# EAGLE design PIC_backpack (EAGLE 8.2.1)
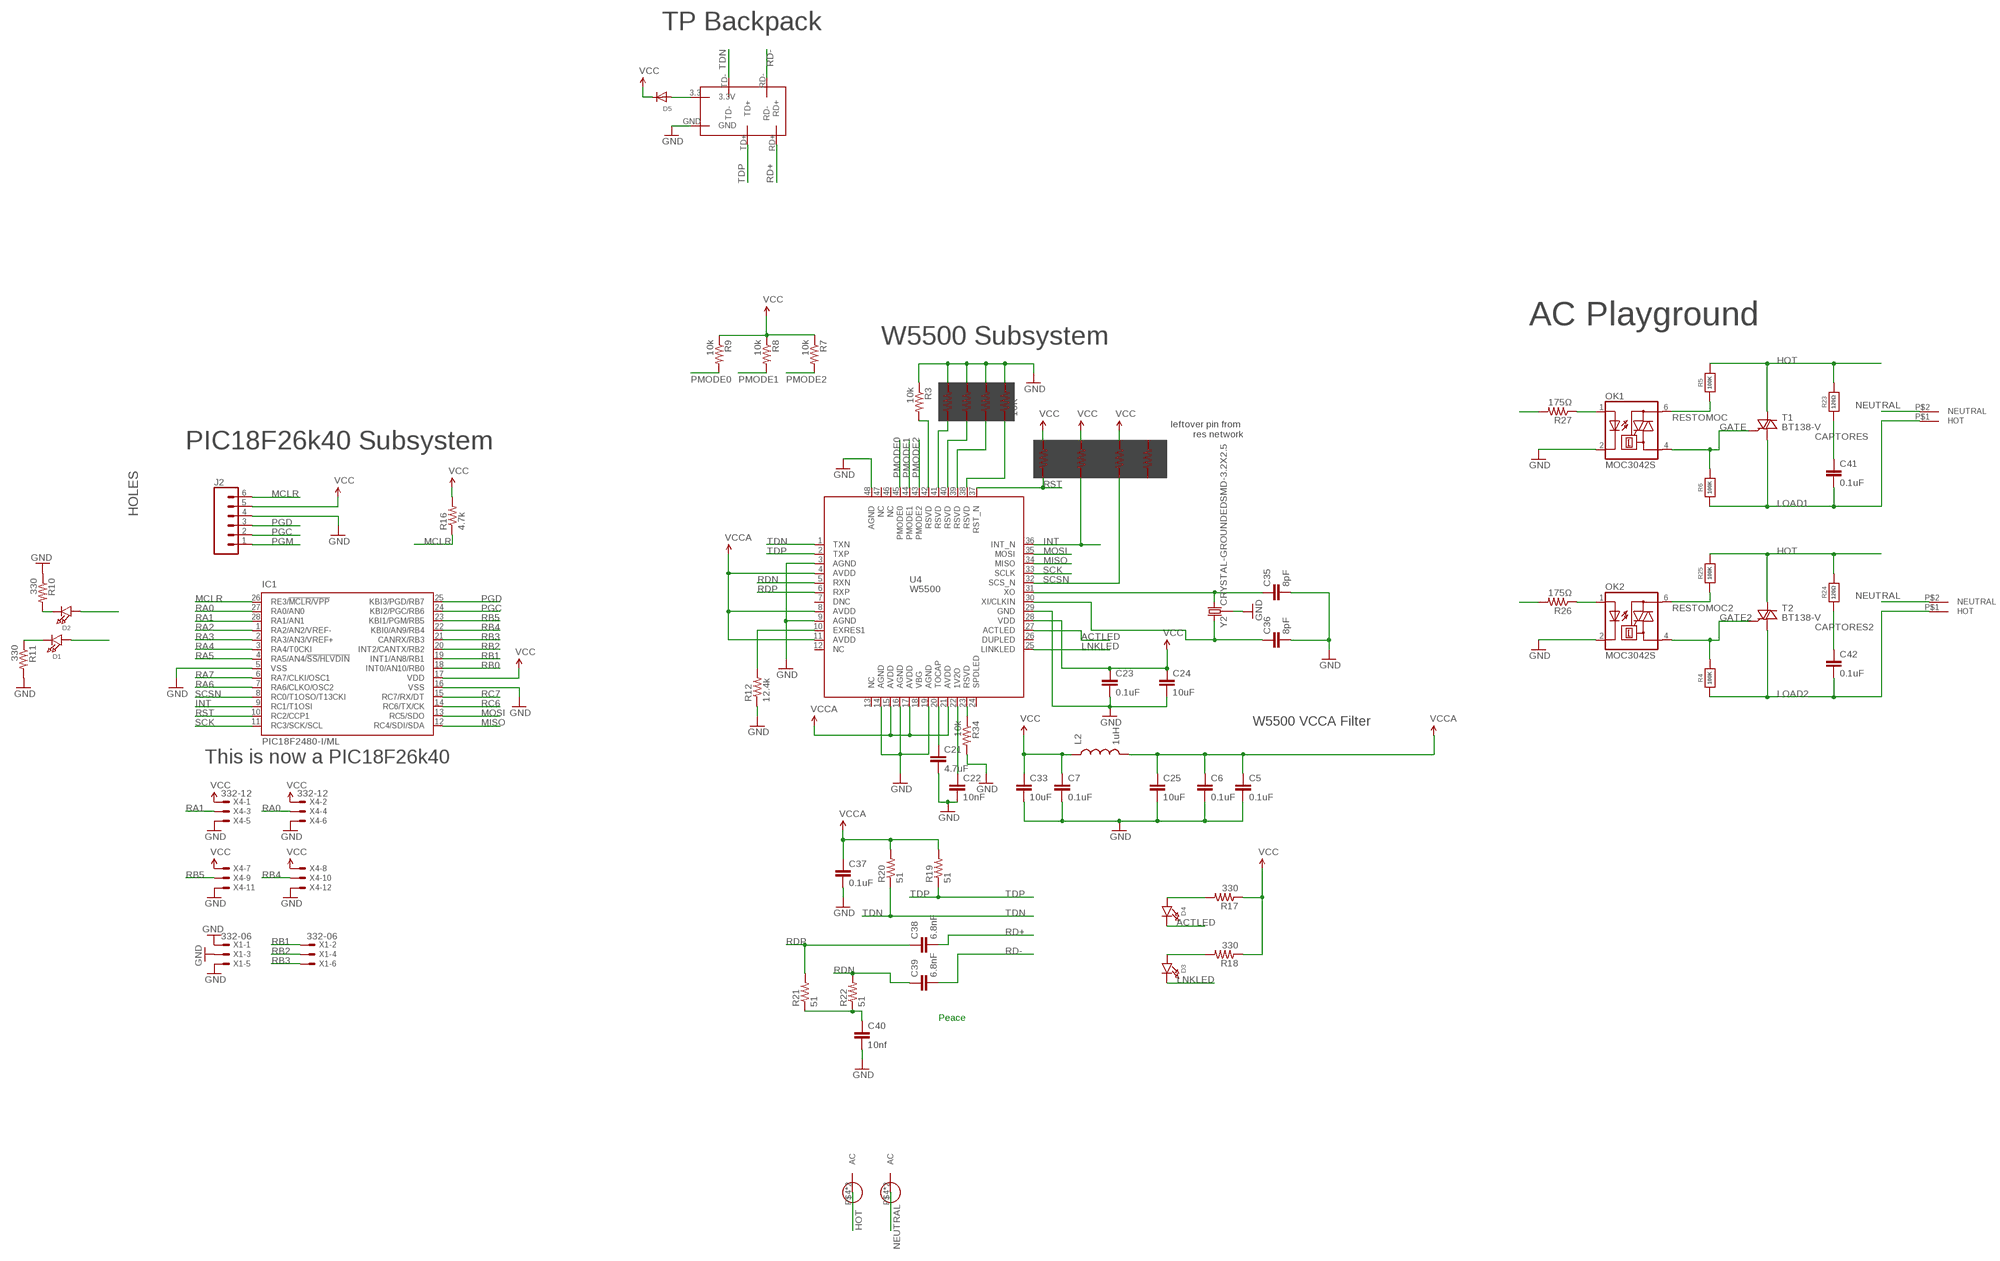
[diagram p0: schematic, sheet 1]

## Parts
C5  0.1uF  CAP0603-CAP  [0603-CAP]
C6  0.1uF  CAP0603-CAP  [0603-CAP]
C7  0.1uF  CAP0603-CAP  [0603-CAP]
C21  4.7uF  CAP0603-CAP  [0603-CAP]
C22  10nF  CAP0603-CAP  [0603-CAP]
C23  0.1uF  CAP0603-CAP  [0603-CAP]
C24  10uF  CAP0603-CAP  [0603-CAP]
C25  10uF  CAP0603-CAP  [0603-CAP]
C33  10uF  CAP0603-CAP  [0603-CAP]
C35  8pF  CAP0603-CAP  [0603-CAP]
C36  8pF  CAP0603-CAP  [0603-CAP]
C37  0.1uF  CAP0603-CAP  [0603-CAP]
C38  6.8nF  CAP0603-CAP  [0603-CAP]
C39  6.8nF  CAP0603-CAP  [0603-CAP]
C40  10nf  CAP0603-CAP  [0603-CAP]
C41  0.1uF  CAP1210  [1210]
C42  0.1uF  CAP1210  [1210]
D1  LED0603_NOOUTLINE  [CHIPLED_0603_NOOUTLINE]
D2  LED0603_NOOUTLINE  [CHIPLED_0603_NOOUTLINE]
D3  LED0603_NOOUTLINE  [CHIPLED_0603_NOOUTLINE]
D4  LED0603_NOOUTLINE  [CHIPLED_0603_NOOUTLINE]
D5  DIODESOD-123  [SOD-123]
IC1  PIC18F2480-I/ML  [QFN28-ML_6X6MM]
J2  CONN_06NO_SILK_FEMALE_PTH  [1X06_NO_SILK]
L2  1uH  INDUCTOR0603  [0603]
OK1  MOC3042S  [DIL6-SMD]
OK2  MOC3042S  [DIL6-SMD]
R1  10K  RESISTOR_4PACK_US  [RESPACK_4X0603]
R2  10K  RESISTOR_4PACK_US  [RESPACK_4X0603]
R3  10k  RESISTOR0603-RES  [0603-RES]
R4  100K  RESISTOR0805_10MGAP  [0805_10MGAP]
R5  100K  RESISTOR0805_10MGAP  [0805_10MGAP]
R6  100K  RESISTOR0805_10MGAP  [0805_10MGAP]
R7  10k  RESISTOR0603-RES  [0603-RES]
R8  10k  RESISTOR0603-RES  [0603-RES]
R9  10k  RESISTOR0603-RES  [0603-RES]
R10  330  RESISTOR0603-RES  [0603-RES]
R11  330  RESISTOR0603-RES  [0603-RES]
R12  12.4k  RESISTOR0603-RES  [0603-RES]
R16  4.7k  RESISTOR0603-RES  [0603-RES]
R17  330  RESISTOR0603-RES  [0603-RES]
R18  330  RESISTOR0603-RES  [0603-RES]
R19  51  RESISTOR0603-RES  [0603-RES]
R20  51  RESISTOR0603-RES  [0603-RES]
R21  51  RESISTOR0603-RES  [0603-RES]
R22  51  RESISTOR0603-RES  [0603-RES]
R23  120Ω  RESISTOR0805_10MGAP  [0805_10MGAP]
R24  120Ω  RESISTOR0805_10MGAP  [0805_10MGAP]
R25  100K  RESISTOR0805_10MGAP  [0805_10MGAP]
R26  175Ω  RESISTOR0603-RES  [0603-RES]
R27  175Ω  RESISTOR0603-RES  [0603-RES]
R34  10k  RESISTOR0603-RES  [0603-RES]
T1  BT138-V  [TO220BV]
T2  BT138-V  [TO220BV]
U4  W5500  [W5500]
U$1  TPLINK_BACKPACK  [BACKPACK_WITH_PROTO]
U$2  AC_BLADE  [AC_BLADE]
U$3  AC_BLADE  [AC_BLADE]
U$4  AC_TERMINAL  [AC_TERMINAL]
U$5  AC_TERMINAL  [AC_TERMINAL]
X1  332-06  [332-06]
X4  332-12  [332-12]
Y2  CRYSTAL-GROUNDEDSMD-3.2X2.5  [CRYSTAL-SMD-3.2X2.5MM]

## Nets
ACTLED: D4.C U4.27(ACTLED)
CAPTORES: C41.1 R23.1
CAPTORES2: C42.1 R24.1
GATE: OK1.4(A1) R6.2 T1.G
GATE2: OK2.4(A1) R4.2 T2.G
GND: C5.2 C6.2 C7.2 C21.2 C22.2 C23.2 C24.2 C25.2 C33.2 C35.2 C36.2 C37.2 C40.2 IC1.5(VSS) IC1.16(VSS) J2.4 OK1.2(C) OK2.2(C) R1.5 R1.6 R1.7 R1.8 R3.1 R10.1 R11.2 R12.1 R34.2 U4.3(AGND) U4.9(AGND) U4.14(AGND) U4.16(AGND) U4.19(AGND) U4.29(GND) U4.48(AGND) U$1.GND X1.1 X1.3 X1.5 X4.5 X4.6 X4.11 X4.12 Y2.2 Y2.4
HOT: R5.2 R23.2 R24.2 R25.2 T1.T2(A2) T2.T2(A2) U$2.P$4(AC) U$2.P$5(AC)
INT: IC1.9(RC1/T1OSI) R2.3 U4.36(INT_N)
LNKLED: D3.C U4.25(LINKLED)
LOAD1: C41.2 R6.1 T1.T1(A1) U$5.P$1(HOT)
LOAD2: C42.2 R4.1 T2.T1(A1) U$4.P$1(HOT)
MCLR: IC1.26(RE3/!MCLR/VPP) J2.6 R16.1
MISO: IC1.12(RC4/SDI/SDA) U4.34(MISO)
MOSI: IC1.13(RC5/SDO) U4.35(MOSI)
N$1: R3.2 U4.42(RSVD)
N$2: D2.C R10.2
N$3: C21.1 U4.20(TOCAP)
N$5: D1.C R11.1
N$8: C22.1 U4.22(1V2O)
N$10: R12.2 U4.10(EXRES1)
N$12: D4.A R17.2
N$13: D3.A R18.2
N$15: D5.A U$1.3.3(3.3V)
N$16: C40.1 R21.1 R22.1
N$17: R1.1 U4.41(RSVD)
N$18: R1.3 U4.39(RSVD)
N$19: R1.2 U4.40(RSVD)
N$21: R1.4 U4.38(RSVD)
N$22: R34.1 U4.23(RSVD)
N$23: C35.1 U4.31(XO) Y2.3
N$24: C36.1 U4.30(XI/CLKIN) Y2.1
N$26: OK1.1(A) R27.1
N$29: OK2.1(A) R26.1
NEUTRAL: U$3.P$4(AC) U$3.P$5(AC) U$4.P$2(NEUTRAL) U$5.P$2(NEUTRAL)
PGC: IC1.24(KBI2/PGC/RB6) J2.2
PGD: IC1.25(KBI3/PGD/RB7) J2.3
PGM: J2.1
PMODE0: R9.2 U4.45(PMODE0)
PMODE1: R8.2 U4.44(PMODE1)
PMODE2: R7.2 U4.43(PMODE2)
RA0: IC1.27(RA0/AN0) X4.4
RA1: IC1.28(RA1/AN1) X4.3
RA2: IC1.1(RA2/AN2/VREF-)
RA3: IC1.2(RA3/AN3/VREF+)
RA4: IC1.3(RA4/T0CKI) R26.2
RA5: IC1.4(RA5/AN4/!SS/HLVDIN) R27.2
RA6: IC1.7(RA6/CLKO/OSC2)
RA7: IC1.6(RA7/CLKI/OSC1)
RB0: IC1.18(INT0/AN10/RB0)
RB1: IC1.19(INT1/AN8/RB1) X1.2
RB2: IC1.20(INT2/CANTX/RB2) X1.4
RB3: IC1.21(CANRX/RB3) X1.6
RB4: IC1.22(KBI0/AN9/RB4) X4.10
RB5: IC1.23(KBI1/PGM/RB5) X4.9
RC6: D2.A IC1.14(RC6/TX/CK)
RC7: D1.A IC1.15(RC7/RX/DT)
RD+: C38.2 U$1.RD+
RD-: C39.2 U$1.RD-
RDN: C39.1 R22.2 U4.5(RXN)
RDP: C38.1 R21.2 U4.6(RXP)
RESTOMOC: OK1.6(A2) R5.1
RESTOMOC2: OK2.6(A2) R25.1
RST: IC1.10(RC2/CCP1) R2.2 U4.37(RST_N)
SCK: IC1.11(RC3/SCK/SCL) U4.33(SCLK)
SCSN: IC1.8(RC0/T1OSO/T13CKI) R2.4 U4.32(SCS_N)
TDN: R20.1 U4.1(TXN) U$1.TD-
TDP: R19.1 U4.2(TXP) U$1.TD+
VCC: C7.1 C23.1 C24.1 C33.1 D5.C IC1.17(VDD) J2.5 L2.1 R2.5 R2.6 R2.7 R7.1 R8.1 R9.1 R16.2 R17.1 R18.1 U4.28(VDD) X4.1 X4.2 X4.7 X4.8
VCCA: C5.1 C6.1 C25.1 C37.1 L2.2 R19.2 R20.2 U4.4(AVDD) U4.8(AVDD) U4.11(AVDD) U4.15(AVDD) U4.17(AVDD) U4.21(AVDD)
Unconnected: R2.1 R2.8 U4.7(DNC) U4.12(NC) U4.13(NC) U4.18(VBG) U4.24(SPDLED) U4.26(DUPLED) U4.46(NC) U4.47(NC)

## Notes on the sheet
- TP Backpack
- AC Playground
- W5500 Subsystem
- leftover pin from 
  res network
- PIC18F26k40 Subsystem
- HOLES
- W5500 VCCA Filter
- This is now a PIC18F26k40
- Peace

## Library data of the parts
C5-C7 C21-C25 C33 C35-C40 = SparkFun-Passives:CAP: Capacitor Standard 0603 ceramic capacitor, and 0.1" leaded capacitor.
C41 C42 = SparkFun-Capacitors:CAP: Capacitor Standard 0603 ceramic capacitor, and 0.1" leaded capacitor.
D1-D4 = microbuilder:LED: LED 0603 - 0603 Surface Mount Package 2mA: Green LED - Low Power (3.9mcd, 2ma, 1.7Vf) - Digikey: 475-2709-2-ND Orange LED - Low Power (9.8mcd, 2ma, 1.8Vf) - Digikey: 475-1194-2-ND Red LED - Low Power (5mcd, 2ma, 1.8Vf) - Digikey: 475-1195-2-ND Yellow LED - Low Power (7mcd, 2ma, 1.8Vf) - Digikey: 475-1196-2-ND 5mA: Blue LED - Low Power (17mcd, 5ma, 2.9Vf) - Digikey: LNJ937W8CRACT-ND 0805 - 0805 Surface Mount Package 2mA: Red LED (8.8mcd, 2mA, 1.8Vf, Clear) - Low Power [Digikey: 475-2510-1-ND] Green LED (5mcd, 2mA, 1.8Vf, Clear) - Low Power [Digikey: 475-2730-1-ND] Yellow LED (11.3mcd, 2mA, 1.8Vf, Clear) - Low Power [Digikey: 475-2555-1-ND] 20mA: Red LED (104mcd, 20mA, Diffused) - LS R976 [Digikey: 475-1278-6-ND] Red LED (12mcd, 20mA, 2.0Vf, Clear) - APT2012EC [Digikey: 754-1128-1-ND] Green LED (15mcd, 20mA, 2.2Vf, Clear) - APT2012GC [Digikey: 754-1131-1-ND] Orange LED (160mcd, 20mA, 2.1Vf, Clear) - APT2012SECK [Digikey: 754-1130-1-ND] 1206 - 1206 Surface Mount Package Green LED (26mcd, 20mA, Diffused) - LG N971 [Digikey: 475-1407-6-ND] Red LED (15mcd, 20mA, Diffused) - LH N974 [Digikey: 475-1416-6-ND] Cree - Cree High-Power Surface Mount LEDs XPEBWT-L1-0000-00D50 - White 111lm 350mA 2.9Vf 6200K 110° XTEAWT-00-0000-00000LEE3 - White 114lm 350mA 2.85Vf 5000K 115° Everlight - Everlight 45-21 Series Surface Mount LEDs 45-21/QK2C-B2832AC2CB2/2T - Warm White 2000mcd 20mA 3.25Vf 3050K 120° 45-21/LK2C-B38452C4CB2/2T - Nuetral White 2000mcd 20mA 3.25Vf 4150K 120° 45-21/LK2C-B50634C6CB2/2T - Cold White 2200mcd 20mA 3.25Vf 5650K 120° PLCC2 Reverse Mount LS T77K-J1L2-1-0-2-R18-Z - Red 11.25mcd 2mA 1.8Vf 630nm 120° LO T77K-L1M2-24-Z - Orange 19.6mcd 2mA 1.8Vf 606nm 120° LY T77K-K2M1-26-Z - Yellow 15.7mcd 2mA 1.8Vf 587nm 120°
D5 = adafruit:DIODE: Diode SMADIODE - SMA Surface Mount Package 20V 1A Schottky Diode Digikey: 641-1014-6-ND DO-1N4148 - Through Hole Small Current Diode SOD-123 20V 1 A (.5mV Vf) Schottky Diode - Digikey: MBRX120TPMSCT-ND SOD-323 10V 570mA (.38mV Vf, 3ns) Schottky Diode - Digikey: ZLLS410CT-ND SOD-523 30V 30mA Schottky Diode (RB751S-40TE61) - Digikey: RB751S-40TE61CT-ND SOT23-R/W - SOT23 Package (R = Solder Paste/Reflow Ovens, W = Hand-Soldering) BAT54Film 40V 300mA - Digikey: 497-7162-1-ND
IC1 = microchip:PIC18F2*80: 28-Pin Enhanced Flash Microcontrollers with ECAN(TM) Technology 10-Bit A/D and nanoWatt Technology Source: http://www.microchip.com .. 39637a.pdf; MF: MICROCHIP; MPN: PIC18F2480-I/ML; OC_FARNELL: 1556179; OC_NEWARK: 71J7235
J2 = SparkFun-Connectors:CONN_06: Multi connection point. Often used as Generic Header-pin footprint for 0.1 inch spaced/style header connections On any of the 0.1 inch spaced packages, you can populate with these: Break Away Headers - Straight <https://www.sparkfun.com/products/116> (PRT-00116) Break Away Male Headers - Right Angle <https://www.sparkfun.com/products/553> (PRT-00553) Female Headers <https://www.sparkfun.com/products/115> (PRT-00115) Break Away Headers - Machine Pin <https://www.sparkfun.com/products/117> (PRT-00117) Break Away Female Headers - Swiss Machine Pin <https://www.sparkfun.com/products/743> (PRT-00743) Arduino Stackable Header - 6 Pin <https://www.sparkfun.com/products/9280> (PRT-09280) For SCREWTERMINALS and SPRING TERMINALS visit here: Screw Terimnals on SparkFun.com <https://www.sparkfun.com/search/results?term=Screw+Terminals> (5mm/3.5mm/2.54mm spacing) This device is also useful as a general connection point to wire up your design to another part of your project. Our various solder wires solder well into these plated through hole pads. Hook-Up Wire - Assortment (Stranded, 22 AWG) <https://www.sparkfun.com/products/11375> (PRT-11375) Hook-Up Wire - Assortment (Solid Core, 22 AWG) <https://www.sparkfun.com/products/11367> (PRT-11367) View the entire wire category on our website here <https://www.sparkfun.com/categories/141>; PROD_ID: CONN-08437
L2 = SparkFun-Passives:INDUCTOR: Inductors Basic Inductor/Choke - 0603 and 1206. Footprints are not proven and vary greatly between part numbers. INDUCTOR POWER 3.3UH 4.0A SMD 0.197" L x 0.197" W x 0.177" H (5.00mm x 5.00mm x 4.50mm)
OK1 OK2 = optocoupler:MOC30*: 6-Pin DIP Zero-Cross Optoisolators Triac Driver Output (250/400 Volt Peak) Source: Data sheet <http://www.fairchildsemi.com/ds/MO/MOC3031M.pdf> The old path of data sheet not more available 2013-05-06.; MF: FAIRCHILD SEMICONDUCTOR; MPN: MOC3042SM; OC_FARNELL: unknown; OC_NEWARK: 34C1339
R1 R2 = microbuilder:RESISTOR_4PACK_US: Resistor Packs (4 resistors) 4 x 0603 10K 1/16W - Digikey: YC164J-10KCT-ND
R3 R7-R12 R16-R22 R26 R27 R34 = SparkFun-Passives:RESISTOR: Resistor Basic schematic elements and footprints for 0603, 1206, and PTH resistors.
R4-R6 R23-R25 = microbuilder:RESISTOR: Resistors For new designs, use the packages preceded by an '_' character since they are more reliable: The following footprints should be used on most boards: _0402 - Standard footprint for regular board layouts _0603 - Standard footprint for regular board layouts _0805 - Standard footprint for regular board layouts _1206 - Standard footprint for regular board layouts For extremely tight-pitch boards where space is at a premium, the following 'micro-pitch' footprints can be used (smaller pads, no silkscreen outline, etc.): _0402MP - Micro-pitch footprint for very dense/compact boards _0603MP - Micro-pitch footprint for very dense/compact boards _0805MP - Micro-pitch footprint for very dense/compact boards _1206MP - Micro-pitch footprint for very dense/compact boards
T1 T2 = triac:BT138: TRIAC Source: http://www.semiconductors.philips.com BT138_SERIES_2.pdf
U4 = W5500:W5500
U$1 = Heep:TPLINK_BACKPACK
U$2 U$3 = Heep:AC_BLADE
U$4 U$5 = Heep:AC_TERMINAL
X1 = con-garry:332-06: 6 Pin - 2mm Dual Row Source: www.mpe-connector.de / garry_shortform_2012.pdf
X4 = con-garry:332-12: 12 Pin - 2mm Dual Row Source: www.mpe-connector.de / garry_shortform_2012.pdf
Y2 = SparkFun-Clocks:CRYSTAL-GROUNDED: Crystals w/ Ground Pin (Generic) These are passive quartz crystals, which can be used as a clock source for a microcontroller. Crystal's are usually two-terminal devices. A third terminal may be optionally connected to ground, as recommended by the manufaturer.

## Board
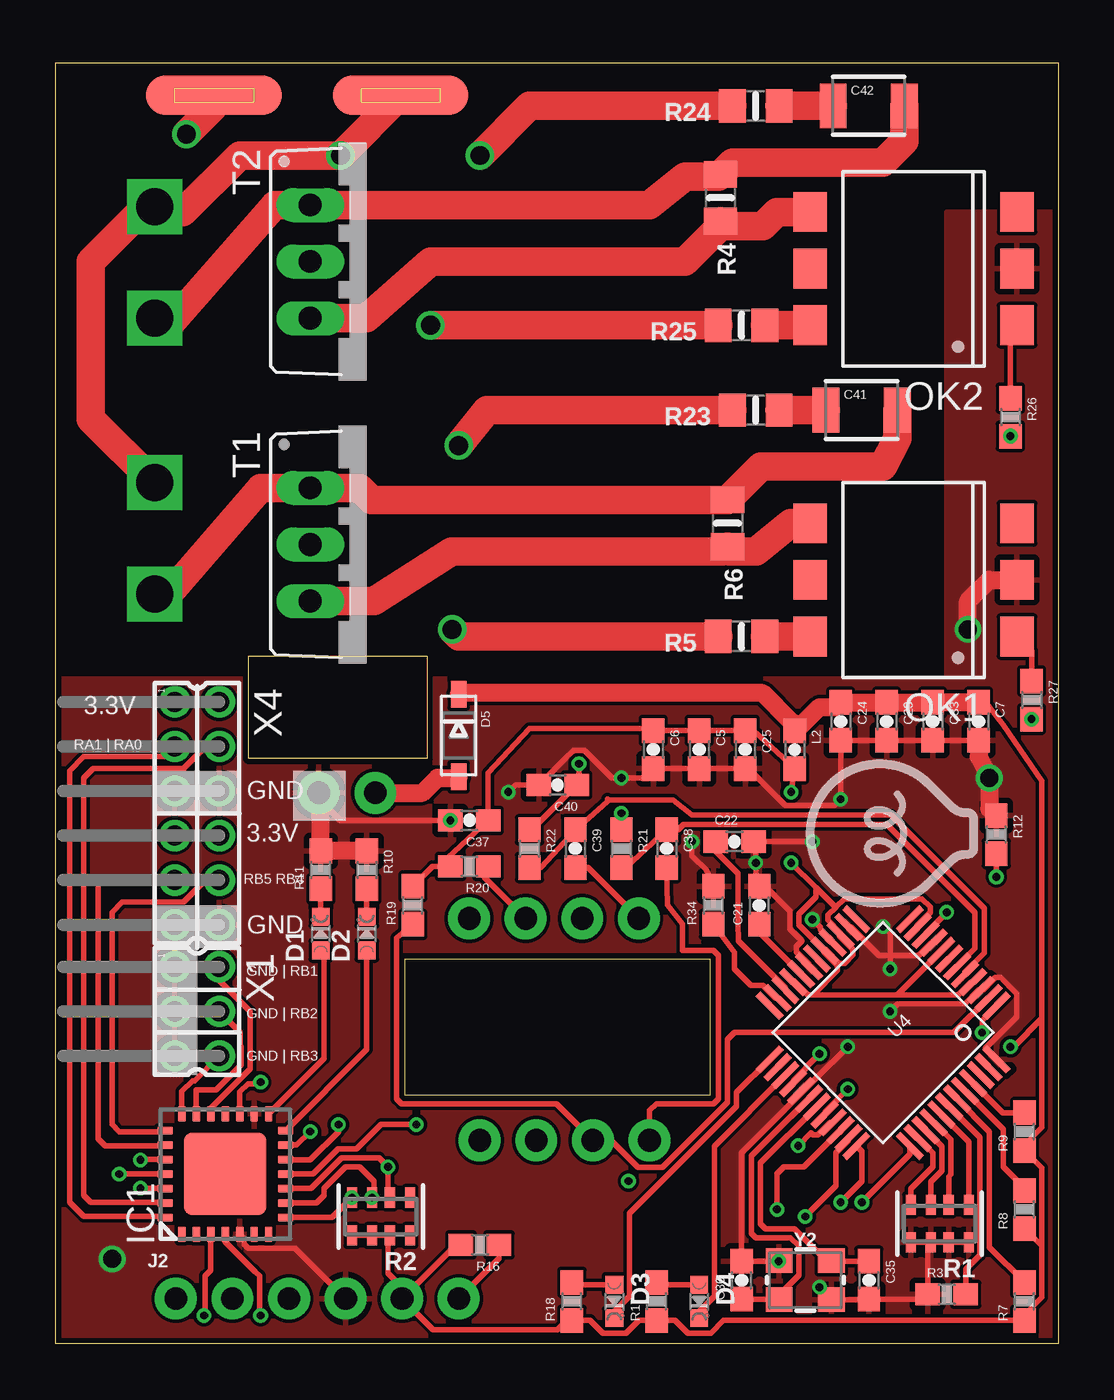
[diagram p1: board, top side]
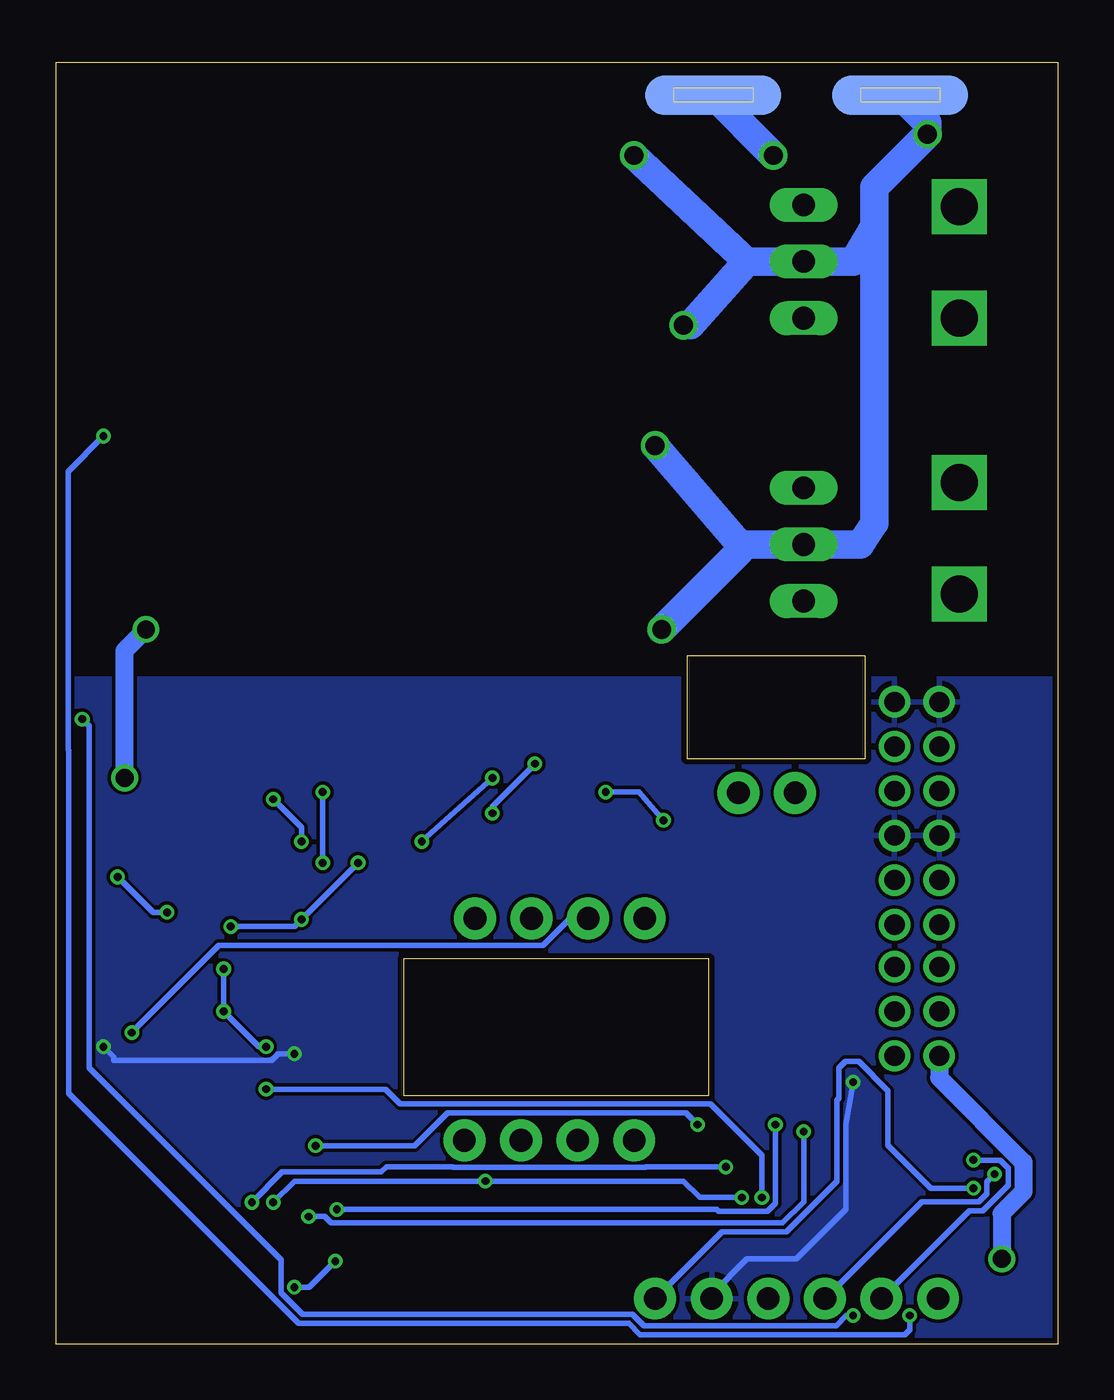
[diagram p2: board, bottom side, seen from below]

Size 45 x 57.5 mm. Coordinates in mm from the lower left corner, seen from the top.
Copper layers (1*16): Top 0.035mm / dielectric 1.5mm / Bottom 0.035mm
Design rules "SeeedStudio_2layer_DRU_no_angle_20140221": minimum track width 6mil, minimum drill 12mil, track to track 6mil, track to pad 6mil, pad to pad 6mil, via to via 6mil, smd to smd 0mil, copper to edge 10mil, drill to drill 10mil, minimum pad ring 10mil, minimum via ring 6mil, stop-mask expansion 2mil, vias tented up to drill 100mil, thermal gap 10mil

### Footprints (pad centres in the part's own frame; a part is rotated, then mirrored left to right if it is on the bottom)
0603-CAP = smd 1.1 x 1: 1 -0.85,0; 2 0.85,0
1210 = smd 1.2 x 2: 1 -1.6,0; 2 1.6,0
CHIPLED_0603_NOOUTLINE = smd 0.8 x 0.8: A 0,-0.75; C 0,0.75
SOD-123 = smd 1.2 x 0.7: A 1.85,0; C -1.85,0
QFN28-ML_6X6MM = smd 0.7 x 0.35: 1 -2.7,1.95; 2 -2.7,1.3; 3 -2.7,0.65; 4 -2.7,0; 5 -2.7,-0.65; 6 -2.7,-1.3; 7 -2.7,-1.95; 15 2.7,-1.95; 16 2.7,-1.3; 17 2.7,-0.65; 18 2.7,0; 19 2.7,0.65; 20 2.7,1.3; 21 2.7,1.95 | smd 0.35 x 0.7: 8 -1.95,-2.7; 9 -1.3,-2.7; 10 -0.65,-2.7; 11 0,-2.7; 12 0.65,-2.7; 13 1.3,-2.7; 14 1.95,-2.7; 22 1.95,2.7; 23 1.3,2.7; 24 0.65,2.7; 25 0,2.7; 26 -0.65,2.7; 27 -1.3,2.7; 28 -1.95,2.7 | smd 3.7 x 3.7: EXP 0,0
1X06_NO_SILK = drill 1.016 pad 1.88: 1 0,0; 2 2.54,0; 3 5.08,0; 4 7.62,0; 5 10.16,0; 6 12.7,0
0603 = smd 1.1 x 1: 1 -0.85,0; 2 0.85,0
DIL6-SMD = smd 1.78 x 1.52: 1 -2.54,-4.645; 2 0,-4.645; 3 2.54,-4.645; 4 2.54,4.645; 5 0,4.645; 6 -2.54,4.645
RESPACK_4X0603 = smd 0.45 x 0.9: 1 -1.3,-0.85; 2 -0.4,-0.85; 3 0.4,-0.85; 4 1.3,-0.85; 5 1.3,0.85; 6 0.4,0.85; 7 -0.4,0.85; 8 -1.3,0.85
0603-RES = smd 1.1 x 1: 1 -0.85,0; 2 0.85,0
0805_10MGAP = smd 1.2 x 1.5: 1 -1.05,0; 2 1.05,0
TO220BV = drill 1.016 long: G 2.54,-2.54; T1 -2.54,-2.54; T2 0,-2.54
W5500 = smd 1.5 x 0.3: 1 -4.45,2.75; 2 -4.45,2.25; 3 -4.45,1.75; 4 -4.45,1.25; 5 -4.45,0.75; 6 -4.45,0.25; 7 -4.45,-0.25; 8 -4.45,-0.75; 9 -4.45,-1.25; 10 -4.45,-1.75; 11 -4.45,-2.25; 12 -4.45,-2.75; 25 4.45,-2.75; 26 4.45,-2.25; 27 4.45,-1.75; 28 4.45,-1.25; 29 4.45,-0.75; 30 4.45,-0.25; 31 4.45,0.25; 32 4.45,0.75; 33 4.45,1.25; 34 4.45,1.75; 35 4.45,2.25; 36 4.45,2.75 | smd 0.3 x 1.5: 13 -2.75,-4.45; 14 -2.25,-4.45; 15 -1.75,-4.45; 16 -1.25,-4.45; 17 -0.75,-4.45; 18 -0.25,-4.45; 19 0.25,-4.45; 20 0.75,-4.45; 21 1.25,-4.45; 22 1.75,-4.45; 23 2.25,-4.45; 24 2.75,-4.45; 37 2.75,4.45; 38 2.25,4.45; 39 1.75,4.45; 40 1.25,4.45; 41 0.75,4.45; 42 0.25,4.45; 43 -0.25,4.45; 44 -0.75,4.45; 45 -1.25,4.45; 46 -1.75,4.45; 47 -2.25,4.45; 48 -2.75,4.45
BACKPACK_WITH_PROTO = drill 1.016 pad 1.88: 3.3 14.357,24.729; GND 11.817,24.729; P$3 18.564,19.093; P$4 19.038,9.132; P$6 23.644,19.093; P$8 21.578,9.132; RD+ 26.658,9.132; RD- 26.184,19.093; TD+ 24.118,9.132; TD- 21.104,19.093
AC_BLADE = smd 6.096 x 1.778: P$4 0,0 | smd 6.096 x 1.778 bottom: P$5 0,0
AC_TERMINAL = drill 1.651 square: P$1 0,0; P$2 5,0
332-06 = drill 0.9 pad 1.27: 1 -2,-1; 2 -2,1; 3 0,-1; 4 0,1; 5 2,-1; 6 2,1
332-12 = drill 0.9 pad 1.27: 1 -5,-1; 2 -5,1; 3 -3,-1; 4 -3,1; 5 -1,-1; 6 -1,1; 7 1,-1; 8 1,1; 9 3,-1; 10 3,1; 11 5,-1; 12 5,1
CRYSTAL-SMD-3.2X2.5MM = smd 1.2 x 1.1: 1 -1.175,-0.875; 2 1.175,-0.875; 3 1.175,0.875; 4 -1.175,0.875

### Placement (x,y rotation side)
C5  28.89,26.67 270 top
C6  26.82,26.67 270 top
C7  41.43,27.94 270 top
C21  31.58,19.68 90 top
C22  0.01uF  [0603-CAP]  30.47,22.54 0 top
C23  37.3,27.94 270 top
C24  35.24,27.94 270 top
C25  30.95,26.67 270 top
C33  39.36,27.94 270 top
C35  36.51,2.86 270 top
C36  30.79,2.86 90 top
C37  18.57,23.49 180 top
C38  27.43,22.22 270 top
C39  23.33,22.22 270 top
C40  0.01uF  [0603-CAP]  22.54,25.08 180 top
C41  36.18,41.91 0 top
C42  36.49,55.56 0 top
D1  BLUE  [CHIPLED_0603_NOOUTLINE]  11.9,18.41 0 top
D2  RED  [CHIPLED_0603_NOOUTLINE]  13.96,18.41 0 top
D3  GREEN  [CHIPLED_0603_NOOUTLINE]  25.08,1.9 180 top
D4  YELLOW  [CHIPLED_0603_NOOUTLINE]  28.89,1.9 180 top
D5  18.09,27.3 270 top
IC1  7.61,7.62 90 top
J2  5.39,2.03 0 top
L2  33.17,26.67 270 top
OK1  38.51,34.29 90 top
OK2  38.51,48.26 90 top
R1  39.68,5.4 180 top
R2  14.6,5.71 180 top
R3  40,2.22 0 top
R4  29.84,51.43 270 top
R5  178  [0805_10MGAP]  30.79,31.75 180 top
R6  30.16,36.83 270 top
R7  43.49,1.9 90 top
R8  43.49,6.03 90 top
R9  43.49,9.52 90 top
R10  13.96,21.27 270 top
R11  11.9,21.27 90 top
R12  42.22,22.86 270 top
R16  19.04,4.44 180 top
R17  26.98,1.9 90 top
R18  23.17,1.9 90 top
R19  16.03,19.68 90 top
R20  18.57,21.43 180 top
R21  25.39,22.22 270 top
R22  21.27,22.22 270 top
R23  31.43,41.91 180 top
R24  31.43,55.56 180 top
R25  178  [0805_10MGAP]  30.79,45.72 180 top
R26  51  [0603-RES]  42.86,41.59 270 top
R27  51  [0603-RES]  43.81,28.89 270 top
R34  29.52,19.68 90 top
T1  13.96,35.88 270 top
T2  13.96,48.58 270 top
U4  37.14,13.97 225 top
U$1  -0.01,0 0 top
U$2  7.1,56.04 0 top
U$3  15.48,56.04 0 top
U$4  4.44,46.04 90 top
U$5  4.44,33.65 90 top
U$10  [HEEPLOGOSMALL]  42.22,18.41 90 top
X1  6.34,14.92 270 top
X4  6.34,23.81 270 top
Y2  33.65,2.86 0 top

### Tracks (layer width: path | path; a pad name or v marks a point on that pad's centre or on a via)
ACTLED
  Top 0.254: D4.C 28.89,1.46 29.57,2.14 29.57,8.87 U4.27
CAPTORES
  Top 1.27: R23.1 C41.1
CAPTORES2
  Top 1.27: R24.1 C42.1
GATE
  Top 1.27: T1.G 14.28,33.34 17.77,35.56 29.94,35.56 R6.2 30.25,35.56 31.43,35.56 33.01,36.83 OK1.4
GATE2
  Top 1.27: OK2.4 32.38,50.8 31.74,50.16 30.06,50.16 R4.2 29.84,50.16 28.25,48.58 16.82,48.58 13.96,46.04 T2.G
GND  (via drill 0.35, 0.8)
  Top 0.254: R1.6 R1.7 R1.8 | R1.6 39.15,4.41 R3.1 38.93,2.01 C35.2 36.48,1.98 Y2.2 34.82,2 v34.28,2.54 | R1.6 R1.5 | Y2.4 v32.45,3.71 C36.2 30.79,8.58 33.56,11.35 | 31.43,20.95 C21.2 | 31.43,20.95 v31.43,21.59 31.43,22.44 C22.2 v33.97,22.54 | C7.2 C33.2 C23.2 C24.2 v35.24,24.45 34.95,24.16 32.76,24.16 31.1,25.82 C25.2 C5.2 C6.2 26.56,25.4 v25.39,25.4 24.98,25.4 23.74,26.64 23.24,26.64 22.88,26.29 22.88,26.28 C40.2 20.63,25.08 v20.31,24.76 | U4.14 35.69,18.71 36.95,17.44 37.46,17.44 | U4.9 39.3,18 38.74,17.44 37.46,17.44 | U4.16 34.88,18.03 34.32,18.59 34.32,18.7 v33.97,19.05 | U4.19 33.82,17.04 33.26,17.6 33.26,17.83 33.5,18.08 32.95,18.63 32.95,19.43 31.43,20.95 | 37.46,17.44 37.46,18.41 v37.14,18.73 | v37.46,14.92 37.8,15.26 40.81,15.26 41.43,15.88 U4.3 41.62,15.88 42.19,16.44 42.42,16.44 43.15,15.71 43.15,14.67 41.84,13.36 41.74,13.26 U4.48 | 37.46,17.44 v37.46,16.83 | 33.56,11.35 U4.29 | 33.56,11.35 34.13,11.92 v35.55,13.33 | R34.2 29.2,21.27 28.57,21.91 v28.57,22.54 | U$1.GND 11.81,24.45 | C37.2 12.76,23.49 11.81,24.45 | R11.2 11.81,21.74 11.81,24.45 | IC1.5 8.46,4.72 8.46,4.47 8.64,4.29 10.75,4.29 J2.4
  Top 0.813: U$1.GND 11.9,24.64 R11.2 R10.1 | C7.2 41.43,26.35 v41.9,25.4 41.9,24.03 R12.1 | v40.95,32.07 40.95,33.34 41.9,34.29 OK1.2
  Bottom 0.254: v28.57,22.54 v25.39,25.4 | v31.43,21.59 v33.97,19.05 34.28,18.73 v37.14,18.73 | v37.46,16.83 v37.46,14.92 35.87,13.33 v35.55,13.33 | v33.97,22.54 33.97,23.18 v35.24,24.45 | v34.28,2.54 33.62,2.54 v32.45,3.71 | v20.31,24.76 18.83,24.76 C37.2
  Bottom 0.813: v2.53,3.81 2.53,5.85 1.56,6.83 1.56,8.15 5.34,11.94 X1.5 | v41.9,25.4 41.9,31.11 v40.95,32.07
  other vias: 17.72,23.49
  pour Top: -2.86,29.84 -2.86,-1.59 48.89,-1.59 48.89,50.8 40,50.8 40,29.84
HOT  (via drill 0.85)
  Top 1.27: R25.2 v16.82,45.72 | v18.09,40.32 19.36,41.91 R23.2 | v19.04,53.34 21.27,55.56 R24.2 | R5.2 18.12,31.75 v17.8,32.07 | U$2.P$5 7.1,55.52 v5.87,54.29
  Bottom 1.27: 8.25,50.16 9.2,48.58 T2.T2 13.96,48.58 | 13.96,48.58 v19.04,53.34 | v16.82,45.72 16.5,45.72 13.96,48.58 | 8.25,50.16 8.25,36.83 8.88,35.88 T1.T2 14.28,35.88 | 14.28,35.88 v18.09,40.32 | 14.28,35.88 14.28,35.58 v17.8,32.07 | 8.25,50.16 8.25,51.91 v5.87,54.29 5.87,54.81 U$2.P$5
INT  (via drill 0.35)
  Top 0.254: v35.24,6.35 36.19,7.3 36.19,8.63 U4.36 | v14.2,6.56 14.28,6.65 14.28,7.3 13.65,7.94 13.01,7.94 12.06,6.98 12.06,6.67 11.71,6.32 IC1.9
  Bottom 0.254: v35.24,6.35 34.28,7.3 v25.71,7.3 16.82,7.3 16.08,6.56 14.92,6.56 v14.2,6.56
LNKLED
  Top 0.254: U4.25 30.57,11.28 30.57,10.66 25.76,5.85 25.76,2.14 25.08,1.46 D3.C
LOAD1
  Top 1.27: C41.2 37.78,40.64 37.14,39.37 31.65,39.37 R6.1 14.18,37.88 13.65,38.42 T1.T1 9.2,38.42 5.15,33.73 5.07,33.65 U$5.P$1
LOAD2
  Top 1.27: C42.2 38.09,53.97 37.14,53.02 30.38,53.02 R4.1 29.74,52.39 28.25,52.39 26.66,51.12 T2.T1 9.84,51.12 5.15,45.8 U$4.P$1
MCLR  (via drill 0.35)
  Top 0.254: J2.6 19.89,3.83 R16.1 | v3.8,6.98 3.82,6.97 IC1.26
  Bottom 0.254: J2.6 15.1,5.02 12.2,5.02 9.92,7.3 9.92,10.93 9.84,11.02 9.84,12.38 9.55,12.67 8.95,12.67 7.64,11.36 7.64,8.92 5.71,6.98 v3.8,6.98
MISO  (via drill 0.35)
  Top 0.254: 35.23,9.49 U4.34 33.58,7.94 32.7,7.94 32.38,7.62 v32.38,6.03 | IC1.12 10.33,8.25 11.42,8.25 12.69,9.52 v12.69,9.84
  Bottom 0.254: v12.69,9.84 12.69,8.57 12.69,6.31 13.05,5.96 15.25,5.96 15.32,6.03 v32.38,6.03
MOSI  (via drill 0.35)
  Top 0.254: 35.24,8.89 U4.35 35.59,9.13 35.02,8.57 35.02,7.09 v33.65,5.71 | v11.42,9.52 10.82,8.92 IC1.13
  Bottom 0.254: v33.65,5.71 32.92,5.71 32.63,5.43 12.37,5.43 11.42,6.37 v11.42,9.52
N$1
  Top 0.254: R3.2 40.85,3.34 41.49,3.98 41.49,9.27 U4.42
N$2
  Top 0.254: R10.2 D2.C
N$3
  Top 0.254: C21.1 31.43,18.62 U4.20
N$5
  Top 0.254: D1.C R11.1
N$8
  Top 0.254: U4.22 32.76,15.98 30.65,18.09 30.65,18.24 30.63,18.73 30.63,21.11 29.62,22.12 C22.1
N$10  (via drill 0.35)
  Top 0.254: U4.10 39.05,18.42 v40,19.37 | v42.22,20.95 R12.2
  Bottom 0.254: v40,19.37 40.63,19.37 v42.22,20.95
N$12
  Top 0.254: D4.A 27.08,2.65 R17.2
N$13
  Top 0.254: D3.A 23.27,2.65 R18.2
N$15
  Top 0.813: U$1.3.3 16.47,24.73 17.14,25.4 18.04,25.4 D5.A
N$16  (via drill 0.35)
  Top 0.254: R22.1 21.58,23.28 C40.1 23.49,25.18 v23.49,26.03 | R21.1 v25.39,23.81
  Bottom 0.254: v25.39,23.81 25.39,24.13 v23.49,26.03
N$17
  Top 0.254: R1.1 40.98,9.07 U4.41
N$18
  Top 0.254: R1.3 39.28,7.28 39.77,7.77 39.77,8.87 U4.39
N$19
  Top 0.254: R1.2 40.08,7.51 40.18,7.6 40.18,9.17 U4.40
N$21
  Top 0.254: R1.4 38.38,6.95 39.36,7.94 39.36,8.57 U4.38
N$22
  Top 0.254: U4.23 32.3,15.53 31.74,16.09 31.21,16.09 30.47,16.83 30.47,17.56 R34.1
N$23
  Top 0.254: 33.45,9.92 U4.31 31.64,8.11 31.64,5.4 31.87,5.17 33.16,5.17 34.59,3.73 Y2.3 34.85,3.71 C35.1
N$24
  Top 0.254: C36.1 32.45,2.01 Y2.1 32.47,2.19 33.35,3.07 33.35,4.4 32.99,4.76 31.43,4.76 31.23,4.96 31.23,8.45 33.79,11 U4.30 33.01,10.2
N$26
  Top 0.254: R27.1 43.81,31.09 OK1.1
N$29
  Top 0.254: R26.1 42.86,45.42 OK2.1
NEUTRAL  (via drill 0.85)
  Top 1.27: U$5.P$2 1.58,41.51 1.58,48.58 3.72,50.72 U$4.P$2 4.52,50.8 5.71,50.8 8.25,53.34 11.74,53.34 v12.78,53.34 U$3.P$5
  Bottom 1.27: U$3.P$5 v12.78,53.34
PGC  (via drill 0.35)
  Top 0.254: v3.8,8.25 3.82,8.27 IC1.24
  Bottom 0.254: J2.2 3.99,5.97 3.38,5.97 2.24,7.11 2.24,7.87 2.6,8.23 3.78,8.23 v3.8,8.25
PGD  (via drill 0.35)
  Top 0.254: v2.85,7.62 IC1.25
  Bottom 0.254: J2.3 6.12,6.38 3.55,6.38 3.2,6.73 3.2,7.27 v2.85,7.62
PMODE0
  Top 0.254: R9.2 42.5,10.37 U4.45
PMODE1
  Top 0.254: R8.2 43.49,6.98 42.54,7.94 42.54,9.63 U4.44
PMODE2
  Top 0.254: U4.43 40.46,10.96 41.9,9.52 41.9,4.34 R7.2
RA0
  Top 0.254: X4.4 6.73,26.81 5.75,25.83 1.69,25.83 1.26,25.4 1.26,6.67 1.58,6.35 4.88,6.35 IC1.27
RA1
  Top 0.254: IC1.28 4.87,5.71 1.26,5.71 0.63,6.35 0.63,25.72 1.26,26.35 4.88,26.35 X4.3
RA4  (via drill 0.35)
  Top 0.254: IC1.3 6.96,3.3 6.71,3.04 6.71,1.32 v6.66,1.27
  Bottom 0.254: v6.66,1.27 6.66,0.63 6.89,0.41 18.76,0.41 19.27,0.91 34.09,0.91 44.42,11.24 44.42,26.64 44.44,26.67 44.44,39.15 R26.2
  other vias: 42.86,40.74
RA5  (via drill 0.35)
  Top 0.254: 8.88,3.31 8.95,3.24 | 8.95,3.24 9.15,3.04 9.15,1.64 v9.2,1.27 | 8.95,3.24 7.61,4.58 IC1.4
  Bottom 0.254: R27.2 43.49,27.72 43.49,12.38 34.89,3.78 34.89,2.29 33.92,1.32 19.1,1.32 18.6,0.81 9.97,0.81 9.51,1.27 v9.2,1.27
  other vias: 43.81,28.04
RB1
  Top 0.254: IC1.19 6.96,10.58 8.73,12.35 8.73,14.92 7.34,16.31 X1.2
RB2
  Top 0.254: IC1.20 6.31,11.4 7.21,11.4 8.33,12.51 8.33,13.33 8.29,13.37 8.29,13.98 X1.4
RB3
  Top 0.254: X1.6 6.23,11.81 6.15,11.81 5.66,11.32 IC1.21
RB4
  Top 0.254: X4.10 6.73,20.81 5.75,19.83 3,19.83 2.53,19.37 2.53,9.84 2.85,9.52 4.87,9.52 IC1.22
RB5
  Top 0.254: X4.9 2.07,20.81 1.9,20.64 1.9,9.21 2.22,8.89 4.88,8.89 IC1.23
RC6
  Top 0.254: IC1.14 13.96,13.22 D2.A
RC7
  Top 0.254: IC1.15 12.06,12.81 12.06,17.51 D1.A
RD+
  Top 0.254: C38.2 27.46,19.7 28.14,18.86 28.14,17.65 29.53,17.65 29.75,17.43 29.75,11 29.53,10.77 26.96,10.77 26.66,10.48 26.66,9.14 U$1.RD+
RD-
  Top 0.254: C39.2 23.9,21.37 U$1.RD-
RDN
  Top 0.254: R22.2 21.79,21.37 C39.1 24.76,24.34 24.76,24.45 24.79,24.42 27.72,24.42 28.57,23.73 37.48,23.73 41.67,19.54 41.67,17.54 40.82,16.69 U4.5
RDP
  Top 0.254: R21.2 25.6,21.37 C38.1 27.93,23.07 28.17,23.32 37.31,23.32 41.27,19.37 41.27,17.74 U4.6
RESTOMOC
  Top 1.27: R5.1 OK1.6
RESTOMOC2
  Top 1.27: R25.1 OK2.6
RST  (via drill 0.35)
  Top 0.254: U4.37 38.34,8.5 v36.19,6.35 | IC1.10 11.47,6.97 12.84,8.34 14.51,8.34 v14.92,7.94 14.92,6.65 R2.2
  Bottom 0.254: v36.19,6.35 34.83,7.71 30.38,7.71 30.16,7.94 27.18,7.94 27.16,7.91 18.53,7.91 18.5,7.94 v14.92,7.94
SCK  (via drill 0.35)
  Top 0.254: U4.33 34.78,9.94 34.22,9.38 33.98,9.38 33.9,9.46 v33.33,8.89 | v16.19,9.84 14.6,9.84 13.51,8.75 12.67,8.75 11.54,7.62 IC1.11
  Bottom 0.254: v33.33,8.89 28.89,8.89 27.41,10.37 16.71,10.37 v16.19,9.84
SCSN  (via drill 0.35)
  Top 0.254: U4.32 34.52,10.39 35.09,10.95 35.09,10.96 v35.55,11.43 | IC1.8 12.4,5.67 v13.3,6.56
  Bottom 0.254: v35.55,11.43 30.19,11.43 29.53,10.77 15.6,10.77 13.3,8.47 v13.3,6.56
TDN  (via drill 0.35)
  Top 0.254: R20.1 19.26,20.93 U$1.TD- | v41.59,13.97 41.59,14.53 U4.1
  Bottom 0.254: U$1.TD- 21.91,19.09 23.13,17.87 37.68,17.87 v41.59,13.97
TDP
  Top 0.254: 16.28,18.42 R19.1 16.03,18.8 15.29,18.22 15.29,11 15.52,10.77 22.47,10.77 U$1.TD+ 24.93,9.13 26.15,7.91 27.25,7.91 30.16,10.83 30.16,13.66 30.47,13.97 40.32,13.97 U4.2
VCC  (via drill 0.35)
  Top 0.254: R18.1 23.07,0.95 | R18.1 23.98,1.05 24.56,0.48 25.59,0.48 26.17,1.05 R17.1 27.79,1.05 28.37,0.48 29.4,0.48 29.98,1.05 R7.1 43.49,1.31 44.27,2.09 44.27,4.4 | R8.1 44.27,4.4 | 44.27,4.4 44.27,7.9 R9.1 43.49,8.93 44.27,9.71 44.27,14.6 | 44.27,14.6 44.27,25.26 42.54,27.78 41.9,28.57 41.59,28.89 41.05,28.89 C7.1 | U4.28 33.11,11.81 33.67,12.37 33.67,12.41 v34.28,13.02 | R2.5 R2.6 R2.7 14.92,4.78 14.92,3.17 15.55,2.54 J2.5 | v42.86,13.33 43,13.33 44.27,14.6 | J2.5 17.96,4.44 R16.2 | J2.5 16.95,0.63 22.54,0.63 22.96,1.05 R18.1 | 8.25,10.33 IC1.17 8.26,11.3 8.64,11.68 9.13,11.68 v9.2,11.75
  Top 0.813: C7.1 C33.1 C23.1 C24.1 35.02,28.57 34.28,28.57 33.23,27.52 L2.1 33.01,27.94 31.74,29.21 18.15,29.21 D5.C
  Bottom 0.254: v34.28,13.02 35.01,13.02 35.3,12.73 42.39,12.73 42.39,12.87 v42.86,13.33 | v9.2,11.75 9.52,9.84 9.52,6.03 11.74,3.81 13.96,3.81 15.55,2.22 J2.5
  pour Bottom: -2.86,29.84 -2.86,-1.59 50.16,-1.59 50.16,29.84
VCCA  (via drill 0.35)
  Top 0.254: R19.2 16.92,21.43 R20.2 17.56,21.79 C37.1 19.42,25.61 21.27,27.62 26.88,27.62 C6.1 C5.1 C25.1 31.31,27.52 L2.2 v33.01,24.76 | 33.77,15.67 33.16,16.28 U4.21 33.21,16.23 33.77,15.67 | U4.17 34.47,17.6 35.09,16.98 35.09,16.75 34,15.67 | U4.17 34.57,17.7 35.19,17.08 35.42,17.08 35.79,17.46 35.79,17.69 35.18,18.3 U4.15 35.23,18.45 34.67,19.02 34.67,19.25 35.01,19.59 | 35.01,19.59 34.12,20.48 | 34.12,20.48 v33.01,21.59 | 33.77,15.67 34,15.67 | U4.4 41.07,16.23 40.51,15.67 37.78,15.67 | 37.78,15.67 34,15.67 | 34.12,20.48 34.12,20.07 33.36,19.3 33.36,18.8 34.01,18.15 34.02,18.15 U4.17 | 35.02,19.6 35.4,19.98 38.88,19.98 39.26,19.6 39.26,19.37 38.65,18.76 U4.11 | 35.02,19.6 | 35.02,19.6 35.01,19.59 | U4.8 37.78,15.67
  Bottom 0.254: v33.01,21.59 v33.01,24.76

### Text on the board
tPlace: 3.3V | RA1 | RA0 | GND | 3.3V | RB5 RB4 | GND | GND | RB1 | GND | RB2 | GND | RB3